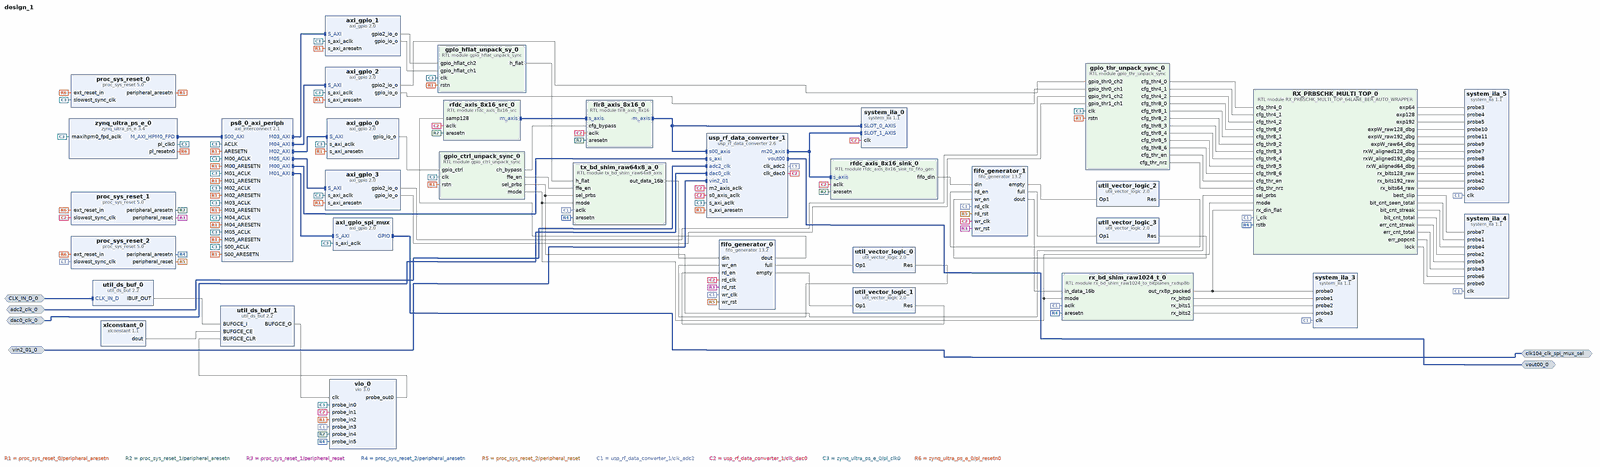
[diagram p0: block diagram of the top level, whole]
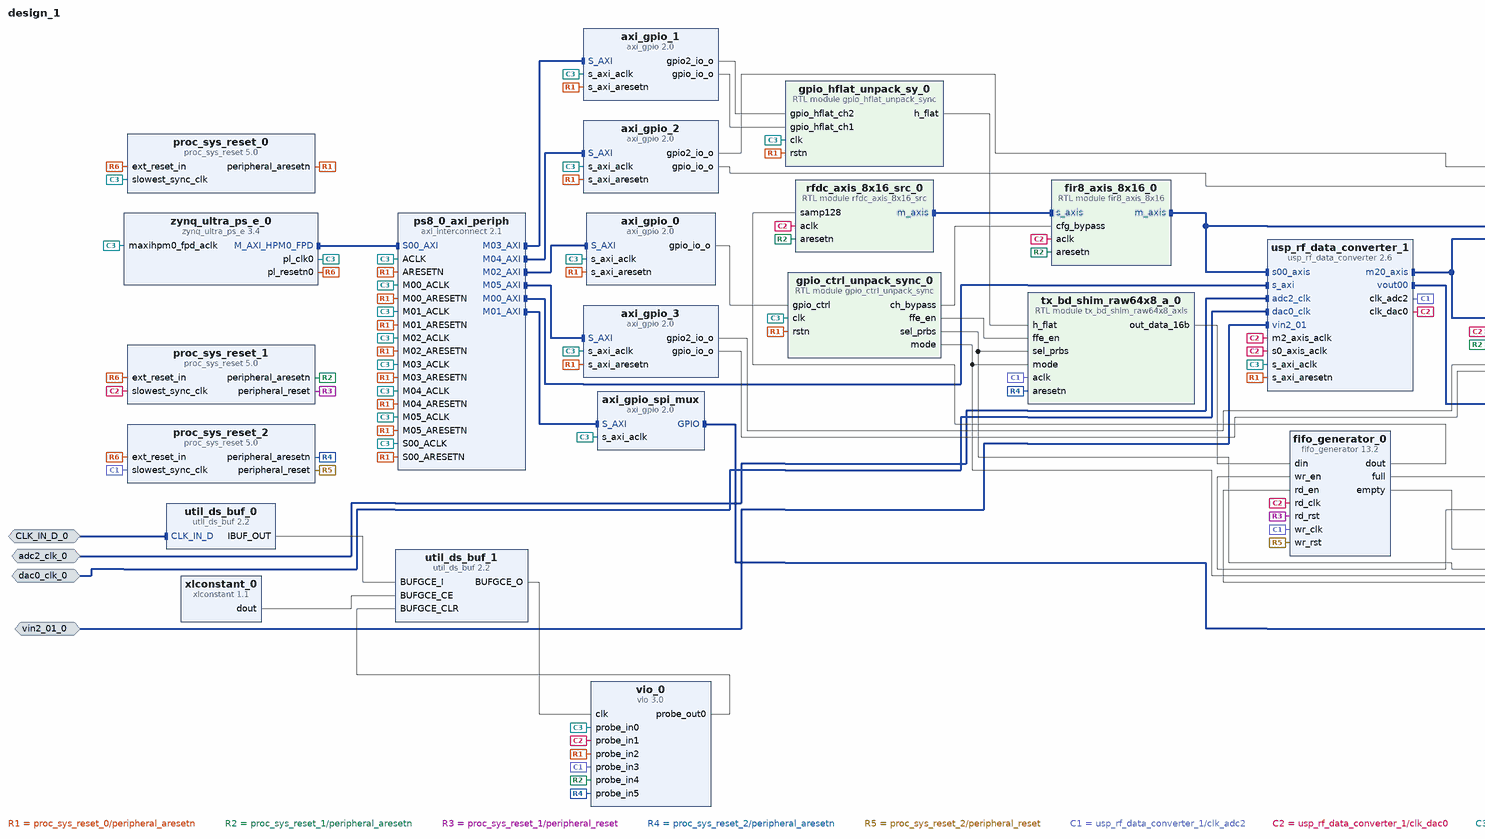
[diagram p1: block diagram of the top level, left part]
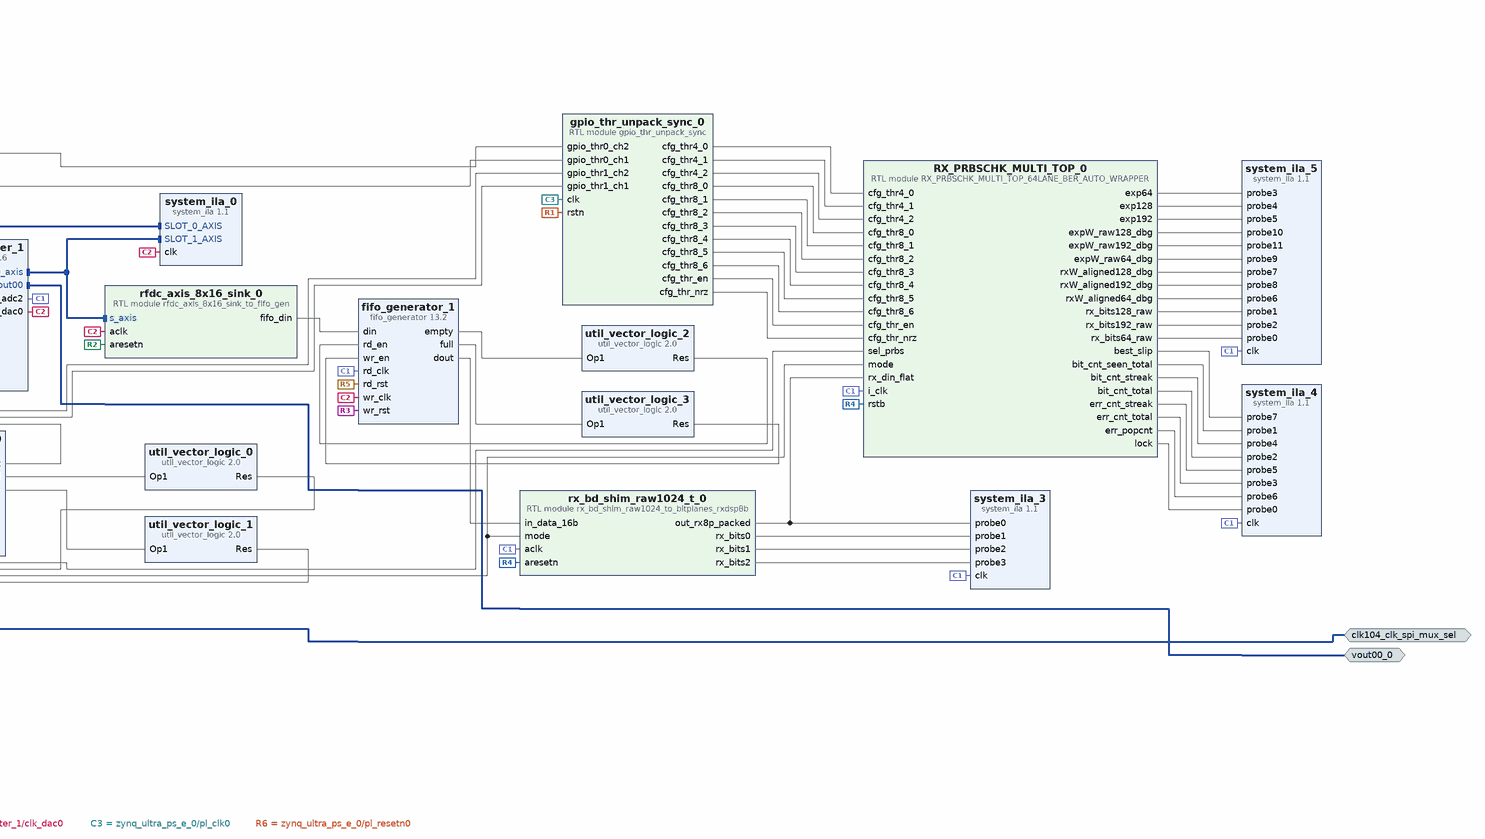
[diagram p2: block diagram of the top level, right part]
# Vivado block design design_1, xczu48dr-fsvg1517-2-e, Vivado 2022.2
create_bd_design design_1

create_bd_intf_port -mode Master -vlnv xilinx.com:interface:gpio_rtl:1.0 clk104_clk_spi_mux_sel
create_bd_intf_port -mode Master -vlnv xilinx.com:interface:diff_analog_io_rtl:1.0 vout00_0
create_bd_intf_port -mode Slave -vlnv xilinx.com:interface:diff_clock_rtl:1.0 adc2_clk_0
set_property -dict {CONFIG.FREQ_HZ 100000000} [get_bd_intf_ports adc2_clk_0]
create_bd_intf_port -mode Slave -vlnv xilinx.com:interface:diff_clock_rtl:1.0 dac0_clk_0
set_property -dict {CONFIG.FREQ_HZ 100000000} [get_bd_intf_ports dac0_clk_0]
create_bd_intf_port -mode Slave -vlnv xilinx.com:interface:diff_clock_rtl:1.0 CLK_IN_D_0
create_bd_intf_port -mode Slave -vlnv xilinx.com:interface:diff_analog_io_rtl:1.0 vin2_01_0

create_bd_cell -type ip -vlnv xilinx.com:ip:proc_sys_reset:5.0 proc_sys_reset_0
create_bd_cell -type ip -vlnv xilinx.com:ip:axi_gpio:2.0 axi_gpio_spi_mux
set_property -dict {CONFIG.C_ALL_OUTPUTS 1 CONFIG.C_GPIO_WIDTH 2 CONFIG.C_IS_DUAL 0} [get_bd_cells axi_gpio_spi_mux]
create_bd_cell -type ip -vlnv xilinx.com:ip:axi_interconnect:2.1 ps8_0_axi_periph
set_property -dict {CONFIG.NUM_MI 6} [get_bd_cells ps8_0_axi_periph]
create_bd_cell -type ip -vlnv xilinx.com:ip:system_ila:1.1 system_ila_0
set_property -dict [list \
  CONFIG.C_DATA_DEPTH 4096 \
  CONFIG.C_MON_TYPE INTERFACE \
  CONFIG.C_NUM_MONITOR_SLOTS 2 \
  CONFIG.C_SLOT 1 \
  CONFIG.C_SLOT_0_INTF_TYPE xilinx.com:interface:axis_rtl:1.0 \
  CONFIG.C_SLOT_1_INTF_TYPE xilinx.com:interface:axis_rtl:1.0 \
] [get_bd_cells system_ila_0]
create_bd_cell -type ip -vlnv xilinx.com:ip:usp_rf_data_converter:2.6 usp_rf_data_converter_1
set_property -dict [list \
  CONFIG.ADC2_Clock_Dist 0 \
  CONFIG.ADC2_Clock_Source 2 \
  CONFIG.ADC2_Outclk_Freq 31.250 \
  CONFIG.ADC2_PLL_Enable true \
  CONFIG.ADC2_Refclk_Freq 250.000 \
  CONFIG.ADC2_Sampling_Rate 2 \
  CONFIG.ADC_CalOpt_Mode20 2 \
  CONFIG.ADC_Coarse_Mixer_Freq20 3 \
  CONFIG.ADC_Data_Width20 8 \
  CONFIG.ADC_Decimation_Mode20 1 \
  CONFIG.ADC_Dither20 false \
  CONFIG.ADC_Mixer_Type20 1 \
  CONFIG.ADC_RTS false \
  CONFIG.ADC_Slice00_Enable false \
  CONFIG.ADC_Slice10_Enable false \
  CONFIG.ADC_Slice20_Enable true \
  CONFIG.ADC_Slice30_Enable false \
  CONFIG.DAC0_Clock_Dist 0 \
  CONFIG.DAC0_Clock_Source 4 \
  CONFIG.DAC0_Outclk_Freq 250.000 \
  CONFIG.DAC0_PLL_Enable true \
  CONFIG.DAC0_Refclk_Freq 250.000 \
  CONFIG.DAC0_Sampling_Rate 2 \
  CONFIG.DAC_Coarse_Mixer_Freq00 3 \
  CONFIG.DAC_Data_Width00 8 \
  CONFIG.DAC_Interpolation_Mode00 1 \
  CONFIG.DAC_Mixer_Mode00 2 \
  CONFIG.DAC_Mixer_Type00 1 \
  CONFIG.DAC_Mode00 0 \
  CONFIG.DAC_Nyquist00 0 \
  CONFIG.DAC_Slice00_Enable true \
  CONFIG.DAC_Slice02_Enable false \
  CONFIG.DAC_Slice10_Enable false \
  CONFIG.DAC_Slice20_Enable false \
  CONFIG.DAC_Slice30_Enable false \
] [get_bd_cells usp_rf_data_converter_1]
create_bd_cell -type ip -vlnv xilinx.com:ip:util_ds_buf:2.2 util_ds_buf_0
set_property -dict {CONFIG.DIFF_CLK_IN_BOARD_INTERFACE default_sysclk_c0_300mhz} [get_bd_cells util_ds_buf_0]
create_bd_cell -type ip -vlnv xilinx.com:ip:util_ds_buf:2.2 util_ds_buf_1
set_property -dict {CONFIG.C_BUFGCE_DIV 2 CONFIG.C_BUF_TYPE BUFGCE_DIV} [get_bd_cells util_ds_buf_1]
create_bd_cell -type ip -vlnv xilinx.com:ip:vio:3.0 vio_0
set_property -dict {CONFIG.C_NUM_PROBE_IN 6} [get_bd_cells vio_0]
create_bd_cell -type ip -vlnv xilinx.com:ip:xlconstant:1.1 xlconstant_0
create_bd_cell -type ip -vlnv xilinx.com:ip:zynq_ultra_ps_e:3.4 zynq_ultra_ps_e_0
set_property -dict [list \
  CONFIG.CAN0_BOARD_INTERFACE custom \
  CONFIG.CAN1_BOARD_INTERFACE custom \
  CONFIG.CSU_BOARD_INTERFACE custom \
  CONFIG.DP_BOARD_INTERFACE custom \
  CONFIG.GEM0_BOARD_INTERFACE custom \
  CONFIG.GEM1_BOARD_INTERFACE custom \
  CONFIG.GEM2_BOARD_INTERFACE custom \
  CONFIG.GEM3_BOARD_INTERFACE custom \
  CONFIG.GPIO_BOARD_INTERFACE custom \
  CONFIG.IIC0_BOARD_INTERFACE custom \
  CONFIG.IIC1_BOARD_INTERFACE custom \
  CONFIG.NAND_BOARD_INTERFACE custom \
  CONFIG.PCIE_BOARD_INTERFACE custom \
  CONFIG.PJTAG_BOARD_INTERFACE custom \
  CONFIG.PMU_BOARD_INTERFACE custom \
  CONFIG.PSU_BANK_0_IO_STANDARD LVCMOS18 \
  CONFIG.PSU_BANK_1_IO_STANDARD LVCMOS18 \
  CONFIG.PSU_BANK_2_IO_STANDARD LVCMOS18 \
  CONFIG.PSU_BANK_3_IO_STANDARD LVCMOS33 \
  CONFIG.PSU_USB3__DUAL_CLOCK_ENABLE 1 \
  CONFIG.PSU__CAN1__PERIPHERAL__ENABLE 0 \
  CONFIG.PSU__CRF_APB__ACPU_CTRL__FREQMHZ 1200 \
  CONFIG.PSU__CRF_APB__ACPU_CTRL__SRCSEL APLL \
  CONFIG.PSU__CRF_APB__APLL_CTRL__SRCSEL PSS_REF_CLK \
  CONFIG.PSU__CRF_APB__DBG_FPD_CTRL__FREQMHZ 250 \
  CONFIG.PSU__CRF_APB__DBG_FPD_CTRL__SRCSEL IOPLL \
  CONFIG.PSU__CRF_APB__DBG_TRACE_CTRL__FREQMHZ 250 \
  CONFIG.PSU__CRF_APB__DBG_TRACE_CTRL__SRCSEL IOPLL \
  CONFIG.PSU__CRF_APB__DBG_TSTMP_CTRL__FREQMHZ 250 \
  CONFIG.PSU__CRF_APB__DBG_TSTMP_CTRL__SRCSEL IOPLL \
  CONFIG.PSU__CRF_APB__DDR_CTRL__FREQMHZ 1067 \
  CONFIG.PSU__CRF_APB__DDR_CTRL__SRCSEL DPLL \
  CONFIG.PSU__CRF_APB__DPDMA_REF_CTRL__FREQMHZ 600 \
  CONFIG.PSU__CRF_APB__DPDMA_REF_CTRL__SRCSEL APLL \
  CONFIG.PSU__CRF_APB__DPLL_CTRL__SRCSEL PSS_REF_CLK \
  CONFIG.PSU__CRF_APB__DP_AUDIO_REF_CTRL__SRCSEL RPLL \
  CONFIG.PSU__CRF_APB__DP_STC_REF_CTRL__SRCSEL RPLL \
  CONFIG.PSU__CRF_APB__DP_VIDEO_REF_CTRL__SRCSEL VPLL \
  CONFIG.PSU__CRF_APB__GDMA_REF_CTRL__FREQMHZ 600 \
  CONFIG.PSU__CRF_APB__GDMA_REF_CTRL__SRCSEL APLL \
  CONFIG.PSU__CRF_APB__GPU_REF_CTRL__FREQMHZ 500 \
  CONFIG.PSU__CRF_APB__GPU_REF_CTRL__SRCSEL IOPLL \
  CONFIG.PSU__CRF_APB__TOPSW_LSBUS_CTRL__FREQMHZ 100 \
  CONFIG.PSU__CRF_APB__TOPSW_LSBUS_CTRL__SRCSEL IOPLL \
  CONFIG.PSU__CRF_APB__TOPSW_MAIN_CTRL__FREQMHZ 533.33 \
  CONFIG.PSU__CRF_APB__TOPSW_MAIN_CTRL__SRCSEL DPLL \
  CONFIG.PSU__CRF_APB__VPLL_CTRL__SRCSEL PSS_REF_CLK \
  CONFIG.PSU__CRL_APB__ADMA_REF_CTRL__FREQMHZ 500 \
  CONFIG.PSU__CRL_APB__ADMA_REF_CTRL__SRCSEL IOPLL \
  CONFIG.PSU__CRL_APB__CAN1_REF_CTRL__FREQMHZ 100 \
  CONFIG.PSU__CRL_APB__CAN1_REF_CTRL__SRCSEL IOPLL \
  CONFIG.PSU__CRL_APB__CPU_R5_CTRL__FREQMHZ 500 \
  CONFIG.PSU__CRL_APB__CPU_R5_CTRL__SRCSEL IOPLL \
  CONFIG.PSU__CRL_APB__DBG_LPD_CTRL__FREQMHZ 250 \
  CONFIG.PSU__CRL_APB__DBG_LPD_CTRL__SRCSEL IOPLL \
  CONFIG.PSU__CRL_APB__GEM3_REF_CTRL__FREQMHZ 125 \
  CONFIG.PSU__CRL_APB__GEM3_REF_CTRL__SRCSEL IOPLL \
  CONFIG.PSU__CRL_APB__I2C0_REF_CTRL__FREQMHZ 100 \
  CONFIG.PSU__CRL_APB__I2C0_REF_CTRL__SRCSEL IOPLL \
  CONFIG.PSU__CRL_APB__I2C1_REF_CTRL__FREQMHZ 100 \
  CONFIG.PSU__CRL_APB__I2C1_REF_CTRL__SRCSEL IOPLL \
  CONFIG.PSU__CRL_APB__IOPLL_CTRL__SRCSEL PSS_REF_CLK \
  CONFIG.PSU__CRL_APB__IOU_SWITCH_CTRL__FREQMHZ 250 \
  CONFIG.PSU__CRL_APB__IOU_SWITCH_CTRL__SRCSEL IOPLL \
  CONFIG.PSU__CRL_APB__LPD_LSBUS_CTRL__FREQMHZ 100 \
  CONFIG.PSU__CRL_APB__LPD_LSBUS_CTRL__SRCSEL IOPLL \
  CONFIG.PSU__CRL_APB__LPD_SWITCH_CTRL__FREQMHZ 500 \
  CONFIG.PSU__CRL_APB__LPD_SWITCH_CTRL__SRCSEL IOPLL \
  CONFIG.PSU__CRL_APB__PCAP_CTRL__FREQMHZ 200 \
  CONFIG.PSU__CRL_APB__PCAP_CTRL__SRCSEL IOPLL \
  CONFIG.PSU__CRL_APB__PL0_REF_CTRL__FREQMHZ 100 \
  CONFIG.PSU__CRL_APB__PL0_REF_CTRL__SRCSEL IOPLL \
  CONFIG.PSU__CRL_APB__QSPI_REF_CTRL__FREQMHZ 125 \
  CONFIG.PSU__CRL_APB__QSPI_REF_CTRL__SRCSEL IOPLL \
  CONFIG.PSU__CRL_APB__RPLL_CTRL__SRCSEL PSS_REF_CLK \
  CONFIG.PSU__CRL_APB__SDIO1_REF_CTRL__FREQMHZ 200 \
  CONFIG.PSU__CRL_APB__SDIO1_REF_CTRL__SRCSEL IOPLL \
  CONFIG.PSU__CRL_APB__TIMESTAMP_REF_CTRL__FREQMHZ 100 \
  CONFIG.PSU__CRL_APB__TIMESTAMP_REF_CTRL__SRCSEL IOPLL \
  CONFIG.PSU__CRL_APB__UART0_REF_CTRL__FREQMHZ 100 \
  CONFIG.PSU__CRL_APB__UART0_REF_CTRL__SRCSEL IOPLL \
  CONFIG.PSU__CRL_APB__UART1_REF_CTRL__FREQMHZ 100 \
  CONFIG.PSU__CRL_APB__UART1_REF_CTRL__SRCSEL IOPLL \
  CONFIG.PSU__CRL_APB__USB0_BUS_REF_CTRL__FREQMHZ 250 \
  CONFIG.PSU__CRL_APB__USB0_BUS_REF_CTRL__SRCSEL IOPLL \
  CONFIG.PSU__CRL_APB__USB3_DUAL_REF_CTRL__FREQMHZ 20 \
  CONFIG.PSU__CRL_APB__USB3_DUAL_REF_CTRL__SRCSEL IOPLL \
  CONFIG.PSU__CRL_APB__USB3__ENABLE 1 \
  CONFIG.PSU__CSUPMU__PERIPHERAL__VALID 1 \
  CONFIG.PSU__DDRC__BUS_WIDTH {64 Bit} \
  CONFIG.PSU__DDRC__COMPONENTS UDIMM \
  CONFIG.PSU__DDRC__DEVICE_CAPACITY {8192 MBits} \
  CONFIG.PSU__DDRC__DRAM_WIDTH {16 Bits} \
  CONFIG.PSU__DDRC__ECC Disabled \
  CONFIG.PSU__DDRC__MEMORY_TYPE {DDR 4} \
  CONFIG.PSU__DDRC__SPEED_BIN DDR4_2133P \
  CONFIG.PSU__DDR_HIGH_ADDRESS_GUI_ENABLE 1 \
  CONFIG.PSU__DDR__INTERFACE__FREQMHZ 533.500 \
  CONFIG.PSU__DEVICE_TYPE RFSOC \
  CONFIG.PSU__DISPLAYPORT__LANE0__ENABLE 1 \
  CONFIG.PSU__DISPLAYPORT__LANE0__IO {GT Lane1} \
  CONFIG.PSU__DISPLAYPORT__LANE1__ENABLE 1 \
  CONFIG.PSU__DISPLAYPORT__LANE1__IO {GT Lane0} \
  CONFIG.PSU__DISPLAYPORT__PERIPHERAL__ENABLE 1 \
  CONFIG.PSU__DLL__ISUSED 1 \
  CONFIG.PSU__DPAUX__PERIPHERAL__ENABLE 1 \
  CONFIG.PSU__DPAUX__PERIPHERAL__IO {MIO 27 .. 30} \
  CONFIG.PSU__DP__LANE_SEL {Dual Lower} \
  CONFIG.PSU__DP__REF_CLK_FREQ 27 \
  CONFIG.PSU__DP__REF_CLK_SEL {Ref Clk1} \
  CONFIG.PSU__ENET3__FIFO__ENABLE 0 \
  CONFIG.PSU__ENET3__GRP_MDIO__ENABLE 1 \
  CONFIG.PSU__ENET3__GRP_MDIO__IO {MIO 76 .. 77} \
  CONFIG.PSU__ENET3__PERIPHERAL__ENABLE 1 \
  CONFIG.PSU__ENET3__PERIPHERAL__IO {MIO 64 .. 75} \
  CONFIG.PSU__ENET3__PTP__ENABLE 0 \
  CONFIG.PSU__ENET3__TSU__ENABLE 0 \
  CONFIG.PSU__FPGA_PL0_ENABLE 1 \
  CONFIG.PSU__GEM3_COHERENCY 0 \
  CONFIG.PSU__GEM3_ROUTE_THROUGH_FPD 0 \
  CONFIG.PSU__GEM__TSU__ENABLE 0 \
  CONFIG.PSU__GPIO0_MIO__IO {MIO 0 .. 25} \
  CONFIG.PSU__GPIO0_MIO__PERIPHERAL__ENABLE 1 \
  CONFIG.PSU__GPIO1_MIO__IO {MIO 26 .. 51} \
  CONFIG.PSU__GPIO1_MIO__PERIPHERAL__ENABLE 1 \
  CONFIG.PSU__GPU_PP0__POWER__ON 0 \
  CONFIG.PSU__GPU_PP1__POWER__ON 0 \
  CONFIG.PSU__GT__LINK_SPEED HBR \
  CONFIG.PSU__GT__PRE_EMPH_LVL_4 0 \
  CONFIG.PSU__GT__VLT_SWNG_LVL_4 0 \
  CONFIG.PSU__I2C0__PERIPHERAL__ENABLE 1 \
  CONFIG.PSU__I2C0__PERIPHERAL__IO {MIO 14 .. 15} \
  CONFIG.PSU__I2C1__PERIPHERAL__ENABLE 1 \
  CONFIG.PSU__I2C1__PERIPHERAL__IO {MIO 16 .. 17} \
  CONFIG.PSU__IOU_SLCR__IOU_TTC_APB_CLK__TTC0_SEL APB \
  CONFIG.PSU__IOU_SLCR__IOU_TTC_APB_CLK__TTC1_SEL APB \
  CONFIG.PSU__IOU_SLCR__IOU_TTC_APB_CLK__TTC2_SEL APB \
  CONFIG.PSU__IOU_SLCR__IOU_TTC_APB_CLK__TTC3_SEL APB \
  CONFIG.PSU__MAXIGP0__DATA_WIDTH 32 \
  CONFIG.PSU__OVERRIDE_HPX_QOS 0 \
  CONFIG.PSU__OVERRIDE__BASIC_CLOCK 0 \
  CONFIG.PSU__PMU_COHERENCY 0 \
  CONFIG.PSU__PMU__AIBACK__ENABLE 0 \
  CONFIG.PSU__PMU__EMIO_GPI__ENABLE 0 \
  CONFIG.PSU__PMU__EMIO_GPO__ENABLE 0 \
  CONFIG.PSU__PMU__GPI0__ENABLE 0 \
  CONFIG.PSU__PMU__GPI1__ENABLE 0 \
  CONFIG.PSU__PMU__GPI2__ENABLE 0 \
  CONFIG.PSU__PMU__GPI3__ENABLE 0 \
  CONFIG.PSU__PMU__GPI4__ENABLE 0 \
  CONFIG.PSU__PMU__GPI5__ENABLE 0 \
  CONFIG.PSU__PMU__GPO0__ENABLE 1 \
  CONFIG.PSU__PMU__GPO0__IO {MIO 32} \
  CONFIG.PSU__PMU__GPO1__ENABLE 1 \
  CONFIG.PSU__PMU__GPO1__IO {MIO 33} \
  CONFIG.PSU__PMU__GPO2__ENABLE 1 \
  CONFIG.PSU__PMU__GPO2__IO {MIO 34} \
  CONFIG.PSU__PMU__GPO2__POLARITY low \
  CONFIG.PSU__PMU__GPO3__ENABLE 1 \
  CONFIG.PSU__PMU__GPO3__IO {MIO 35} \
  CONFIG.PSU__PMU__GPO3__POLARITY low \
  CONFIG.PSU__PMU__GPO4__ENABLE 1 \
  CONFIG.PSU__PMU__GPO4__IO {MIO 36} \
  CONFIG.PSU__PMU__GPO4__POLARITY low \
  CONFIG.PSU__PMU__GPO5__ENABLE 1 \
  CONFIG.PSU__PMU__GPO5__IO {MIO 37} \
  CONFIG.PSU__PMU__GPO5__POLARITY low \
  CONFIG.PSU__PMU__PERIPHERAL__ENABLE 1 \
  CONFIG.PSU__PMU__PLERROR__ENABLE 0 \
  CONFIG.PSU__PRESET_APPLIED 1 \
  CONFIG.PSU__PSS_REF_CLK__FREQMHZ 33.333 \
  CONFIG.PSU__QSPI_COHERENCY 0 \
  CONFIG.PSU__QSPI_ROUTE_THROUGH_FPD 0 \
  CONFIG.PSU__QSPI__GRP_FBCLK__ENABLE 1 \
  CONFIG.PSU__QSPI__GRP_FBCLK__IO {MIO 6} \
  CONFIG.PSU__QSPI__PERIPHERAL__DATA_MODE x4 \
  CONFIG.PSU__QSPI__PERIPHERAL__ENABLE 1 \
  CONFIG.PSU__QSPI__PERIPHERAL__IO {MIO 0 .. 12} \
  CONFIG.PSU__QSPI__PERIPHERAL__MODE {Dual Parallel} \
  CONFIG.PSU__SATA__LANE1__IO {GT Lane3} \
  CONFIG.PSU__SATA__PERIPHERAL__ENABLE 1 \
  CONFIG.PSU__SATA__REF_CLK_FREQ 125 \
  CONFIG.PSU__SATA__REF_CLK_SEL {Ref Clk3} \
  CONFIG.PSU__SD1_COHERENCY 0 \
  CONFIG.PSU__SD1_ROUTE_THROUGH_FPD 0 \
  CONFIG.PSU__SD1__CLK_100_SDR_OTAP_DLY 0x3 \
  CONFIG.PSU__SD1__CLK_200_SDR_OTAP_DLY 0x3 \
  CONFIG.PSU__SD1__CLK_50_DDR_ITAP_DLY 0x3D \
  CONFIG.PSU__SD1__CLK_50_DDR_OTAP_DLY 0x4 \
  CONFIG.PSU__SD1__CLK_50_SDR_ITAP_DLY 0x15 \
  CONFIG.PSU__SD1__CLK_50_SDR_OTAP_DLY 0x5 \
  CONFIG.PSU__SD1__DATA_TRANSFER_MODE 8Bit \
  CONFIG.PSU__SD1__GRP_CD__ENABLE 1 \
  CONFIG.PSU__SD1__GRP_CD__IO {MIO 45} \
  CONFIG.PSU__SD1__GRP_POW__ENABLE 0 \
  CONFIG.PSU__SD1__GRP_WP__ENABLE 0 \
  CONFIG.PSU__SD1__PERIPHERAL__ENABLE 1 \
  CONFIG.PSU__SD1__PERIPHERAL__IO {MIO 39 .. 51} \
  CONFIG.PSU__SD1__SLOT_TYPE {SD 3.0} \
  CONFIG.PSU__SWDT0__CLOCK__ENABLE 0 \
  CONFIG.PSU__SWDT0__PERIPHERAL__ENABLE 1 \
  CONFIG.PSU__SWDT0__RESET__ENABLE 0 \
  CONFIG.PSU__SWDT1__CLOCK__ENABLE 0 \
  CONFIG.PSU__SWDT1__PERIPHERAL__ENABLE 1 \
  CONFIG.PSU__SWDT1__RESET__ENABLE 0 \
  CONFIG.PSU__TSU__BUFG_PORT_PAIR 0 \
  CONFIG.PSU__TTC0__CLOCK__ENABLE 0 \
  CONFIG.PSU__TTC0__PERIPHERAL__ENABLE 1 \
  CONFIG.PSU__TTC0__WAVEOUT__ENABLE 0 \
  CONFIG.PSU__TTC1__CLOCK__ENABLE 0 \
  CONFIG.PSU__TTC1__PERIPHERAL__ENABLE 1 \
  CONFIG.PSU__TTC1__WAVEOUT__ENABLE 0 \
  CONFIG.PSU__TTC2__CLOCK__ENABLE 0 \
  CONFIG.PSU__TTC2__PERIPHERAL__ENABLE 1 \
  CONFIG.PSU__TTC2__WAVEOUT__ENABLE 0 \
  CONFIG.PSU__TTC3__CLOCK__ENABLE 0 \
  CONFIG.PSU__TTC3__PERIPHERAL__ENABLE 1 \
  CONFIG.PSU__TTC3__WAVEOUT__ENABLE 0 \
  CONFIG.PSU__UART0__BAUD_RATE 115200 \
  CONFIG.PSU__UART0__MODEM__ENABLE 0 \
  CONFIG.PSU__UART0__PERIPHERAL__ENABLE 1 \
  CONFIG.PSU__UART0__PERIPHERAL__IO {MIO 18 .. 19} \
  CONFIG.PSU__UART1__PERIPHERAL__ENABLE 0 \
  CONFIG.PSU__USB0_COHERENCY 0 \
  CONFIG.PSU__USB0__PERIPHERAL__ENABLE 1 \
  CONFIG.PSU__USB0__PERIPHERAL__IO {MIO 52 .. 63} \
  CONFIG.PSU__USB0__REF_CLK_FREQ 26 \
  CONFIG.PSU__USB0__REF_CLK_SEL {Ref Clk2} \
  CONFIG.PSU__USB2_0__EMIO__ENABLE 0 \
  CONFIG.PSU__USB3_0__EMIO__ENABLE 0 \
  CONFIG.PSU__USB3_0__PERIPHERAL__ENABLE 1 \
  CONFIG.PSU__USB3_0__PERIPHERAL__IO {GT Lane2} \
  CONFIG.PSU__USB__RESET__MODE {Boot Pin} \
  CONFIG.PSU__USB__RESET__POLARITY {Active Low} \
  CONFIG.PSU__USE__IRQ0 1 \
  CONFIG.PSU__USE__M_AXI_GP0 1 \
  CONFIG.PSU__USE__M_AXI_GP1 0 \
  CONFIG.PSU__USE__M_AXI_GP2 0 \
  CONFIG.QSPI_BOARD_INTERFACE custom \
  CONFIG.SATA_BOARD_INTERFACE custom \
  CONFIG.SD0_BOARD_INTERFACE custom \
  CONFIG.SD1_BOARD_INTERFACE custom \
  CONFIG.SPI0_BOARD_INTERFACE custom \
  CONFIG.SPI1_BOARD_INTERFACE custom \
  CONFIG.SUBPRESET1 Custom \
  CONFIG.SUBPRESET2 Custom \
  CONFIG.SWDT0_BOARD_INTERFACE custom \
  CONFIG.SWDT1_BOARD_INTERFACE custom \
  CONFIG.TRACE_BOARD_INTERFACE custom \
  CONFIG.TTC0_BOARD_INTERFACE custom \
  CONFIG.TTC1_BOARD_INTERFACE custom \
  CONFIG.TTC2_BOARD_INTERFACE custom \
  CONFIG.TTC3_BOARD_INTERFACE custom \
  CONFIG.UART0_BOARD_INTERFACE custom \
  CONFIG.UART1_BOARD_INTERFACE custom \
  CONFIG.USB0_BOARD_INTERFACE custom \
  CONFIG.USB1_BOARD_INTERFACE custom \
] [get_bd_cells zynq_ultra_ps_e_0]
# 734 more settings of zynq_ultra_ps_e_0 are not shown: defaults, MIO pin electricals, DDR timing, and values the tool derives
create_bd_cell -type ip -vlnv xilinx.com:ip:proc_sys_reset:5.0 proc_sys_reset_1
create_bd_cell -type ip -vlnv xilinx.com:ip:proc_sys_reset:5.0 proc_sys_reset_2
create_bd_cell -type ip -vlnv xilinx.com:ip:fifo_generator:13.2 fifo_generator_0
set_property -dict [list \
  CONFIG.Almost_Empty_Flag true \
  CONFIG.Almost_Full_Flag false \
  CONFIG.Enable_Reset_Synchronization false \
  CONFIG.Fifo_Implementation Independent_Clocks_Block_RAM \
  CONFIG.Full_Flags_Reset_Value 1 \
  CONFIG.Input_Data_Width 1024 \
  CONFIG.Input_Depth 32 \
  CONFIG.Output_Data_Width 128 \
  CONFIG.Output_Register_Type Both \
  CONFIG.Overflow_Flag true \
  CONFIG.Performance_Options Standard_FIFO \
  CONFIG.Read_Data_Count true \
  CONFIG.Underflow_Flag true \
  CONFIG.Valid_Flag true \
  CONFIG.Write_Acknowledge_Flag true \
  CONFIG.Write_Data_Count true \
  CONFIG.asymmetric_port_width true \
] [get_bd_cells fifo_generator_0]
create_bd_cell -type module -reference rfdc_axis_8x16_src rfdc_axis_8x16_src_0
create_bd_cell -type ip -vlnv xilinx.com:ip:util_vector_logic:2.0 util_vector_logic_0
set_property -dict {CONFIG.C_OPERATION not CONFIG.C_SIZE 1} [get_bd_cells util_vector_logic_0]
create_bd_cell -type ip -vlnv xilinx.com:ip:util_vector_logic:2.0 util_vector_logic_1
set_property -dict {CONFIG.C_OPERATION not CONFIG.C_SIZE 1} [get_bd_cells util_vector_logic_1]
create_bd_cell -type ip -vlnv xilinx.com:ip:fifo_generator:13.2 fifo_generator_1
set_property -dict [list \
  CONFIG.Almost_Empty_Flag false \
  CONFIG.Almost_Full_Flag false \
  CONFIG.Enable_Reset_Synchronization false \
  CONFIG.Fifo_Implementation Independent_Clocks_Block_RAM \
  CONFIG.Full_Flags_Reset_Value 1 \
  CONFIG.Input_Data_Width 128 \
  CONFIG.Input_Depth 256 \
  CONFIG.Output_Data_Width 1024 \
  CONFIG.Output_Register_Type Both \
  CONFIG.Overflow_Flag false \
  CONFIG.Performance_Options Standard_FIFO \
  CONFIG.Read_Data_Count false \
  CONFIG.Underflow_Flag false \
  CONFIG.Valid_Flag false \
  CONFIG.Write_Acknowledge_Flag false \
  CONFIG.Write_Data_Count false \
  CONFIG.asymmetric_port_width true \
] [get_bd_cells fifo_generator_1]
create_bd_cell -type ip -vlnv xilinx.com:ip:util_vector_logic:2.0 util_vector_logic_2
set_property -dict {CONFIG.C_OPERATION not CONFIG.C_SIZE 1} [get_bd_cells util_vector_logic_2]
create_bd_cell -type ip -vlnv xilinx.com:ip:util_vector_logic:2.0 util_vector_logic_3
set_property -dict {CONFIG.C_OPERATION not CONFIG.C_SIZE 1} [get_bd_cells util_vector_logic_3]
create_bd_cell -type module -reference rfdc_axis_8x16_sink_to_fifo_gen rfdc_axis_8x16_sink_0
create_bd_cell -type ip -vlnv xilinx.com:ip:system_ila:1.1 system_ila_3
set_property -dict [list \
  CONFIG.C_DATA_DEPTH 4096 \
  CONFIG.C_MON_TYPE NATIVE \
  CONFIG.C_NUM_MONITOR_SLOTS 2 \
  CONFIG.C_NUM_OF_PROBES 4 \
  CONFIG.C_SLOT 1 \
  CONFIG.C_SLOT_0_INTF_TYPE xilinx.com:interface:axis_rtl:1.0 \
  CONFIG.C_SLOT_1_INTF_TYPE xilinx.com:interface:axis_rtl:1.0 \
] [get_bd_cells system_ila_3]
create_bd_cell -type module -reference rx_bd_shim_raw1024_to_bitplanes_rxdsp8b rx_bd_shim_raw1024_t_0
create_bd_cell -type ip -vlnv xilinx.com:ip:system_ila:1.1 system_ila_4
set_property -dict [list \
  CONFIG.C_DATA_DEPTH 16384 \
  CONFIG.C_MON_TYPE NATIVE \
  CONFIG.C_NUM_MONITOR_SLOTS 2 \
  CONFIG.C_NUM_OF_PROBES 8 \
  CONFIG.C_SLOT 1 \
  CONFIG.C_SLOT_0_INTF_TYPE xilinx.com:interface:axis_rtl:1.0 \
  CONFIG.C_SLOT_1_INTF_TYPE xilinx.com:interface:axis_rtl:1.0 \
] [get_bd_cells system_ila_4]
create_bd_cell -type ip -vlnv xilinx.com:ip:axi_gpio:2.0 axi_gpio_0
set_property -dict {CONFIG.C_ALL_OUTPUTS 1} [get_bd_cells axi_gpio_0]
create_bd_cell -type module -reference fir8_axis_8x16 fir8_axis_8x16_0
create_bd_cell -type ip -vlnv xilinx.com:ip:axi_gpio:2.0 axi_gpio_1
set_property -dict {CONFIG.C_ALL_OUTPUTS 1 CONFIG.C_ALL_OUTPUTS_2 1 CONFIG.C_IS_DUAL 1} [get_bd_cells axi_gpio_1]
create_bd_cell -type module -reference gpio_hflat_unpack_sync gpio_hflat_unpack_sy_0
create_bd_cell -type module -reference gpio_ctrl_unpack_sync gpio_ctrl_unpack_sync_0
create_bd_cell -type ip -vlnv xilinx.com:ip:system_ila:1.1 system_ila_5
set_property -dict [list \
  CONFIG.C_DATA_DEPTH 4096 \
  CONFIG.C_MON_TYPE NATIVE \
  CONFIG.C_NUM_MONITOR_SLOTS 2 \
  CONFIG.C_NUM_OF_PROBES 12 \
  CONFIG.C_SLOT 1 \
  CONFIG.C_SLOT_0_INTF_TYPE xilinx.com:interface:axis_rtl:1.0 \
  CONFIG.C_SLOT_1_INTF_TYPE xilinx.com:interface:axis_rtl:1.0 \
] [get_bd_cells system_ila_5]
create_bd_cell -type module -reference tx_bd_shim_raw64x8_axis tx_bd_shim_raw64x8_a_0
create_bd_cell -type module -reference RX_PRBSCHK_MULTI_TOP_64LANE_BER_AUTO_WRAPPER RX_PRBSCHK_MULTI_TOP_0
create_bd_cell -type ip -vlnv xilinx.com:ip:axi_gpio:2.0 axi_gpio_2
set_property -dict {CONFIG.C_ALL_OUTPUTS 1 CONFIG.C_ALL_OUTPUTS_2 1 CONFIG.C_IS_DUAL 1} [get_bd_cells axi_gpio_2]
create_bd_cell -type ip -vlnv xilinx.com:ip:axi_gpio:2.0 axi_gpio_3
set_property -dict {CONFIG.C_ALL_OUTPUTS 1 CONFIG.C_ALL_OUTPUTS_2 1 CONFIG.C_IS_DUAL 1} [get_bd_cells axi_gpio_3]
create_bd_cell -type module -reference gpio_thr_unpack_sync gpio_thr_unpack_sync_0

# ---- connections ----

connect_bd_intf_net -intf_net CLK_IN_D_0_1 [get_bd_intf_ports CLK_IN_D_0] [get_bd_intf_pins util_ds_buf_0/CLK_IN_D]
connect_bd_intf_net [get_bd_intf_pins usp_rf_data_converter_1/s00_axis] [get_bd_intf_pins fir8_axis_8x16_0/m_axis]
connect_bd_intf_net [get_bd_intf_pins usp_rf_data_converter_1/s00_axis] [get_bd_intf_pins system_ila_0/SLOT_0_AXIS]
connect_bd_intf_net -intf_net adc2_clk_0_1 [get_bd_intf_ports adc2_clk_0] [get_bd_intf_pins usp_rf_data_converter_1/adc2_clk]
connect_bd_intf_net [get_bd_intf_ports clk104_clk_spi_mux_sel] [get_bd_intf_pins axi_gpio_spi_mux/GPIO]
connect_bd_intf_net -intf_net dac0_clk_0_1 [get_bd_intf_ports dac0_clk_0] [get_bd_intf_pins usp_rf_data_converter_1/dac0_clk]
connect_bd_intf_net [get_bd_intf_pins usp_rf_data_converter_1/s_axi] [get_bd_intf_pins ps8_0_axi_periph/M00_AXI]
connect_bd_intf_net [get_bd_intf_pins ps8_0_axi_periph/M01_AXI] [get_bd_intf_pins axi_gpio_spi_mux/S_AXI]
connect_bd_intf_net [get_bd_intf_pins ps8_0_axi_periph/M02_AXI] [get_bd_intf_pins axi_gpio_0/S_AXI]
connect_bd_intf_net [get_bd_intf_pins ps8_0_axi_periph/M03_AXI] [get_bd_intf_pins axi_gpio_1/S_AXI]
connect_bd_intf_net [get_bd_intf_pins axi_gpio_2/S_AXI] [get_bd_intf_pins ps8_0_axi_periph/M04_AXI]
connect_bd_intf_net [get_bd_intf_pins axi_gpio_3/S_AXI] [get_bd_intf_pins ps8_0_axi_periph/M05_AXI]
connect_bd_intf_net [get_bd_intf_pins fir8_axis_8x16_0/s_axis] [get_bd_intf_pins rfdc_axis_8x16_src_0/m_axis]
connect_bd_intf_net [get_bd_intf_pins usp_rf_data_converter_1/m20_axis] [get_bd_intf_pins rfdc_axis_8x16_sink_0/s_axis]
connect_bd_intf_net [get_bd_intf_pins usp_rf_data_converter_1/m20_axis] [get_bd_intf_pins system_ila_0/SLOT_1_AXIS]
connect_bd_intf_net [get_bd_intf_ports vout00_0] [get_bd_intf_pins usp_rf_data_converter_1/vout00]
connect_bd_intf_net -intf_net vin2_01_0_1 [get_bd_intf_ports vin2_01_0] [get_bd_intf_pins usp_rf_data_converter_1/vin2_01]
connect_bd_intf_net [get_bd_intf_pins ps8_0_axi_periph/S00_AXI] [get_bd_intf_pins zynq_ultra_ps_e_0/M_AXI_HPM0_FPD]
connect_bd_net [get_bd_pins RX_PRBSCHK_MULTI_TOP_0/best_slip] [get_bd_pins system_ila_4/probe7]
connect_bd_net [get_bd_pins RX_PRBSCHK_MULTI_TOP_0/bit_cnt_seen_total] [get_bd_pins system_ila_4/probe1]
connect_bd_net [get_bd_pins RX_PRBSCHK_MULTI_TOP_0/bit_cnt_streak] [get_bd_pins system_ila_4/probe4]
connect_bd_net [get_bd_pins RX_PRBSCHK_MULTI_TOP_0/bit_cnt_total] [get_bd_pins system_ila_4/probe2]
connect_bd_net [get_bd_pins RX_PRBSCHK_MULTI_TOP_0/err_cnt_streak] [get_bd_pins system_ila_4/probe5]
connect_bd_net [get_bd_pins RX_PRBSCHK_MULTI_TOP_0/err_cnt_total] [get_bd_pins system_ila_4/probe3]
connect_bd_net [get_bd_pins RX_PRBSCHK_MULTI_TOP_0/err_popcnt] [get_bd_pins system_ila_4/probe6]
connect_bd_net [get_bd_pins RX_PRBSCHK_MULTI_TOP_0/exp64] [get_bd_pins system_ila_5/probe3]
connect_bd_net [get_bd_pins RX_PRBSCHK_MULTI_TOP_0/exp128] [get_bd_pins system_ila_5/probe4]
connect_bd_net [get_bd_pins RX_PRBSCHK_MULTI_TOP_0/exp192] [get_bd_pins system_ila_5/probe5]
connect_bd_net [get_bd_pins RX_PRBSCHK_MULTI_TOP_0/expW_raw128_dbg] [get_bd_pins system_ila_5/probe10]
connect_bd_net [get_bd_pins RX_PRBSCHK_MULTI_TOP_0/expW_raw192_dbg] [get_bd_pins system_ila_5/probe11]
connect_bd_net [get_bd_pins RX_PRBSCHK_MULTI_TOP_0/expW_raw64_dbg] [get_bd_pins system_ila_5/probe9]
connect_bd_net [get_bd_pins RX_PRBSCHK_MULTI_TOP_0/lock] [get_bd_pins system_ila_4/probe0]
connect_bd_net [get_bd_pins RX_PRBSCHK_MULTI_TOP_0/rxW_aligned128_dbg] [get_bd_pins system_ila_5/probe7]
connect_bd_net [get_bd_pins RX_PRBSCHK_MULTI_TOP_0/rxW_aligned192_dbg] [get_bd_pins system_ila_5/probe8]
connect_bd_net [get_bd_pins RX_PRBSCHK_MULTI_TOP_0/rxW_aligned64_dbg] [get_bd_pins system_ila_5/probe6]
connect_bd_net [get_bd_pins RX_PRBSCHK_MULTI_TOP_0/rx_bits128_raw] [get_bd_pins system_ila_5/probe1]
connect_bd_net [get_bd_pins RX_PRBSCHK_MULTI_TOP_0/rx_bits192_raw] [get_bd_pins system_ila_5/probe2]
connect_bd_net [get_bd_pins RX_PRBSCHK_MULTI_TOP_0/rx_bits64_raw] [get_bd_pins system_ila_5/probe0]
connect_bd_net [get_bd_pins axi_gpio_0/gpio_io_o] [get_bd_pins gpio_ctrl_unpack_sync_0/gpio_ctrl]
connect_bd_net [get_bd_pins axi_gpio_1/gpio2_io_o] [get_bd_pins gpio_hflat_unpack_sy_0/gpio_hflat_ch2]
connect_bd_net [get_bd_pins axi_gpio_1/gpio_io_o] [get_bd_pins gpio_hflat_unpack_sy_0/gpio_hflat_ch1]
connect_bd_net [get_bd_pins axi_gpio_2/gpio2_io_o] [get_bd_pins gpio_thr_unpack_sync_0/gpio_thr0_ch2]
connect_bd_net [get_bd_pins axi_gpio_2/gpio_io_o] [get_bd_pins gpio_thr_unpack_sync_0/gpio_thr0_ch1]
connect_bd_net [get_bd_pins axi_gpio_3/gpio2_io_o] [get_bd_pins gpio_thr_unpack_sync_0/gpio_thr1_ch2]
connect_bd_net [get_bd_pins axi_gpio_3/gpio_io_o] [get_bd_pins gpio_thr_unpack_sync_0/gpio_thr1_ch1]
connect_bd_net [get_bd_pins fifo_generator_0/dout] [get_bd_pins rfdc_axis_8x16_src_0/samp128]
connect_bd_net [get_bd_pins fifo_generator_0/empty] [get_bd_pins util_vector_logic_1/Op1]
connect_bd_net [get_bd_pins fifo_generator_0/full] [get_bd_pins util_vector_logic_0/Op1]
connect_bd_net [get_bd_pins fifo_generator_1/dout] [get_bd_pins rx_bd_shim_raw1024_t_0/in_data_16b]
connect_bd_net [get_bd_pins fifo_generator_1/empty] [get_bd_pins util_vector_logic_2/Op1]
connect_bd_net [get_bd_pins fifo_generator_1/full] [get_bd_pins util_vector_logic_3/Op1]
connect_bd_net [get_bd_pins gpio_ctrl_unpack_sync_0/ch_bypass] [get_bd_pins fir8_axis_8x16_0/cfg_bypass]
connect_bd_net [get_bd_pins gpio_ctrl_unpack_sync_0/ffe_en] [get_bd_pins tx_bd_shim_raw64x8_a_0/ffe_en]
connect_bd_net [get_bd_pins gpio_hflat_unpack_sy_0/h_flat] [get_bd_pins tx_bd_shim_raw64x8_a_0/h_flat]
connect_bd_net [get_bd_pins gpio_thr_unpack_sync_0/cfg_thr4_0] [get_bd_pins RX_PRBSCHK_MULTI_TOP_0/cfg_thr4_0]
connect_bd_net [get_bd_pins gpio_thr_unpack_sync_0/cfg_thr4_1] [get_bd_pins RX_PRBSCHK_MULTI_TOP_0/cfg_thr4_1]
connect_bd_net [get_bd_pins gpio_thr_unpack_sync_0/cfg_thr4_2] [get_bd_pins RX_PRBSCHK_MULTI_TOP_0/cfg_thr4_2]
connect_bd_net [get_bd_pins gpio_thr_unpack_sync_0/cfg_thr8_0] [get_bd_pins RX_PRBSCHK_MULTI_TOP_0/cfg_thr8_0]
connect_bd_net [get_bd_pins gpio_thr_unpack_sync_0/cfg_thr8_1] [get_bd_pins RX_PRBSCHK_MULTI_TOP_0/cfg_thr8_1]
connect_bd_net [get_bd_pins gpio_thr_unpack_sync_0/cfg_thr8_2] [get_bd_pins RX_PRBSCHK_MULTI_TOP_0/cfg_thr8_2]
connect_bd_net [get_bd_pins gpio_thr_unpack_sync_0/cfg_thr8_3] [get_bd_pins RX_PRBSCHK_MULTI_TOP_0/cfg_thr8_3]
connect_bd_net [get_bd_pins gpio_thr_unpack_sync_0/cfg_thr8_4] [get_bd_pins RX_PRBSCHK_MULTI_TOP_0/cfg_thr8_4]
connect_bd_net [get_bd_pins gpio_thr_unpack_sync_0/cfg_thr8_5] [get_bd_pins RX_PRBSCHK_MULTI_TOP_0/cfg_thr8_5]
connect_bd_net [get_bd_pins gpio_thr_unpack_sync_0/cfg_thr8_6] [get_bd_pins RX_PRBSCHK_MULTI_TOP_0/cfg_thr8_6]
connect_bd_net [get_bd_pins gpio_thr_unpack_sync_0/cfg_thr_en] [get_bd_pins RX_PRBSCHK_MULTI_TOP_0/cfg_thr_en]
connect_bd_net [get_bd_pins gpio_thr_unpack_sync_0/cfg_thr_nrz] [get_bd_pins RX_PRBSCHK_MULTI_TOP_0/cfg_thr_nrz]
connect_bd_net -net hier_rsts_peripheral_aresetn2 [get_bd_pins proc_sys_reset_0/peripheral_aresetn] \
  [get_bd_pins ps8_0_axi_periph/ARESETN] [get_bd_pins ps8_0_axi_periph/S00_ARESETN] \
  [get_bd_pins ps8_0_axi_periph/M00_ARESETN] [get_bd_pins ps8_0_axi_periph/M01_ARESETN] \
  [get_bd_pins usp_rf_data_converter_1/s_axi_aresetn] [get_bd_pins vio_0/probe_in2] \
  [get_bd_pins ps8_0_axi_periph/M02_ARESETN] [get_bd_pins ps8_0_axi_periph/M03_ARESETN] \
  [get_bd_pins gpio_ctrl_unpack_sync_0/rstn] [get_bd_pins axi_gpio_0/s_axi_aresetn] [get_bd_pins axi_gpio_1/s_axi_aresetn] \
  [get_bd_pins gpio_hflat_unpack_sy_0/rstn] [get_bd_pins axi_gpio_2/s_axi_aresetn] [get_bd_pins axi_gpio_3/s_axi_aresetn] \
  [get_bd_pins ps8_0_axi_periph/M04_ARESETN] [get_bd_pins ps8_0_axi_periph/M05_ARESETN] \
  [get_bd_pins gpio_thr_unpack_sync_0/rstn]
connect_bd_net [get_bd_pins proc_sys_reset_1/peripheral_aresetn] \
  [get_bd_pins vio_0/probe_in4] [get_bd_pins rfdc_axis_8x16_src_0/aresetn] [get_bd_pins rfdc_axis_8x16_sink_0/aresetn] \
  [get_bd_pins fir8_axis_8x16_0/aresetn]
connect_bd_net [get_bd_pins proc_sys_reset_1/peripheral_reset] [get_bd_pins fifo_generator_0/rd_rst] [get_bd_pins fifo_generator_1/wr_rst]
connect_bd_net [get_bd_pins proc_sys_reset_2/peripheral_aresetn] \
  [get_bd_pins vio_0/probe_in5] [get_bd_pins rx_bd_shim_raw1024_t_0/aresetn] [get_bd_pins tx_bd_shim_raw64x8_a_0/aresetn] \
  [get_bd_pins RX_PRBSCHK_MULTI_TOP_0/rstb]
connect_bd_net [get_bd_pins proc_sys_reset_2/peripheral_reset] [get_bd_pins fifo_generator_0/wr_rst] [get_bd_pins fifo_generator_1/rd_rst]
connect_bd_net [get_bd_pins rfdc_axis_8x16_sink_0/fifo_din] [get_bd_pins fifo_generator_1/din]
connect_bd_net [get_bd_pins rx_bd_shim_raw1024_t_0/out_rx8p_packed] [get_bd_pins system_ila_3/probe0] [get_bd_pins RX_PRBSCHK_MULTI_TOP_0/rx_din_flat]
connect_bd_net [get_bd_pins rx_bd_shim_raw1024_t_0/rx_bits0] [get_bd_pins system_ila_3/probe1]
connect_bd_net [get_bd_pins rx_bd_shim_raw1024_t_0/rx_bits1] [get_bd_pins system_ila_3/probe2]
connect_bd_net [get_bd_pins rx_bd_shim_raw1024_t_0/rx_bits2] [get_bd_pins system_ila_3/probe3]
connect_bd_net [get_bd_pins tx_bd_shim_raw64x8_a_0/out_data_16b] [get_bd_pins fifo_generator_0/din]
connect_bd_net [get_bd_pins usp_rf_data_converter_1/clk_adc2] \
  [get_bd_pins vio_0/probe_in3] [get_bd_pins proc_sys_reset_2/slowest_sync_clk] [get_bd_pins fifo_generator_0/wr_clk] \
  [get_bd_pins fifo_generator_1/rd_clk] [get_bd_pins system_ila_3/clk] [get_bd_pins rx_bd_shim_raw1024_t_0/aclk] \
  [get_bd_pins system_ila_4/clk] [get_bd_pins system_ila_5/clk] [get_bd_pins tx_bd_shim_raw64x8_a_0/aclk] \
  [get_bd_pins RX_PRBSCHK_MULTI_TOP_0/i_clk]
connect_bd_net [get_bd_pins usp_rf_data_converter_1/clk_dac0] \
  [get_bd_pins system_ila_0/clk] [get_bd_pins usp_rf_data_converter_1/m2_axis_aclk] \
  [get_bd_pins usp_rf_data_converter_1/s0_axis_aclk] [get_bd_pins vio_0/probe_in1] \
  [get_bd_pins proc_sys_reset_1/slowest_sync_clk] [get_bd_pins fifo_generator_0/rd_clk] \
  [get_bd_pins rfdc_axis_8x16_src_0/aclk] [get_bd_pins fifo_generator_1/wr_clk] [get_bd_pins rfdc_axis_8x16_sink_0/aclk] \
  [get_bd_pins fir8_axis_8x16_0/aclk]
connect_bd_net [get_bd_pins util_ds_buf_0/IBUF_OUT] [get_bd_pins util_ds_buf_1/BUFGCE_I]
connect_bd_net [get_bd_pins util_ds_buf_1/BUFGCE_O] [get_bd_pins vio_0/clk]
connect_bd_net [get_bd_pins util_vector_logic_0/Res] [get_bd_pins fifo_generator_0/wr_en]
connect_bd_net [get_bd_pins util_vector_logic_1/Res] [get_bd_pins fifo_generator_0/rd_en]
connect_bd_net [get_bd_pins util_vector_logic_2/Res] [get_bd_pins fifo_generator_1/rd_en]
connect_bd_net [get_bd_pins util_vector_logic_3/Res] [get_bd_pins fifo_generator_1/wr_en]
connect_bd_net [get_bd_pins vio_0/probe_out0] [get_bd_pins util_ds_buf_1/BUFGCE_CLR]
connect_bd_net [get_bd_pins xlconstant_0/dout] [get_bd_pins util_ds_buf_1/BUFGCE_CE]
connect_bd_net -net xlconstant_3_dout [get_bd_pins gpio_ctrl_unpack_sync_0/sel_prbs] \
  [get_bd_pins tx_bd_shim_raw64x8_a_0/sel_prbs] [get_bd_pins RX_PRBSCHK_MULTI_TOP_0/sel_prbs]
connect_bd_net -net xlconstant_6_dout [get_bd_pins gpio_ctrl_unpack_sync_0/mode] \
  [get_bd_pins rx_bd_shim_raw1024_t_0/mode] [get_bd_pins tx_bd_shim_raw64x8_a_0/mode] \
  [get_bd_pins RX_PRBSCHK_MULTI_TOP_0/mode]
connect_bd_net [get_bd_pins zynq_ultra_ps_e_0/pl_clk0] \
  [get_bd_pins proc_sys_reset_0/slowest_sync_clk] [get_bd_pins axi_gpio_spi_mux/s_axi_aclk] \
  [get_bd_pins ps8_0_axi_periph/ACLK] [get_bd_pins ps8_0_axi_periph/S00_ACLK] [get_bd_pins ps8_0_axi_periph/M00_ACLK] \
  [get_bd_pins ps8_0_axi_periph/M01_ACLK] [get_bd_pins usp_rf_data_converter_1/s_axi_aclk] [get_bd_pins vio_0/probe_in0] \
  [get_bd_pins zynq_ultra_ps_e_0/maxihpm0_fpd_aclk] [get_bd_pins axi_gpio_0/s_axi_aclk] \
  [get_bd_pins ps8_0_axi_periph/M02_ACLK] [get_bd_pins ps8_0_axi_periph/M03_ACLK] [get_bd_pins gpio_ctrl_unpack_sync_0/clk] \
  [get_bd_pins gpio_hflat_unpack_sy_0/clk] [get_bd_pins axi_gpio_1/s_axi_aclk] [get_bd_pins axi_gpio_2/s_axi_aclk] \
  [get_bd_pins axi_gpio_3/s_axi_aclk] [get_bd_pins ps8_0_axi_periph/M04_ACLK] [get_bd_pins ps8_0_axi_periph/M05_ACLK] \
  [get_bd_pins gpio_thr_unpack_sync_0/clk]
connect_bd_net [get_bd_pins zynq_ultra_ps_e_0/pl_resetn0] \
  [get_bd_pins proc_sys_reset_0/ext_reset_in] [get_bd_pins proc_sys_reset_1/ext_reset_in] \
  [get_bd_pins proc_sys_reset_2/ext_reset_in]

# ---- address map ----
assign_bd_address -offset 0x00A0000000 -range 256K -target_address_space [get_bd_addr_spaces zynq_ultra_ps_e_0/Data] [get_bd_addr_segs usp_rf_data_converter_1/s_axi/Reg]
assign_bd_address -offset 0x00A0040000 -range 64K -target_address_space [get_bd_addr_spaces zynq_ultra_ps_e_0/Data] [get_bd_addr_segs axi_gpio_spi_mux/S_AXI/Reg]
assign_bd_address -offset 0x00A0050000 -range 64K -target_address_space [get_bd_addr_spaces zynq_ultra_ps_e_0/Data] [get_bd_addr_segs axi_gpio_0/S_AXI/Reg]
assign_bd_address -offset 0x00A0060000 -range 64K -target_address_space [get_bd_addr_spaces zynq_ultra_ps_e_0/Data] [get_bd_addr_segs axi_gpio_1/S_AXI/Reg]
assign_bd_address -offset 0x00A0070000 -range 64K -target_address_space [get_bd_addr_spaces zynq_ultra_ps_e_0/Data] [get_bd_addr_segs axi_gpio_2/S_AXI/Reg]
assign_bd_address -offset 0x00A0080000 -range 64K -target_address_space [get_bd_addr_spaces zynq_ultra_ps_e_0/Data] [get_bd_addr_segs axi_gpio_3/S_AXI/Reg]

validate_bd_design
save_bd_design
